# EAGLE design flukso.sensor.board.v1.2 (EAGLE 5.04)
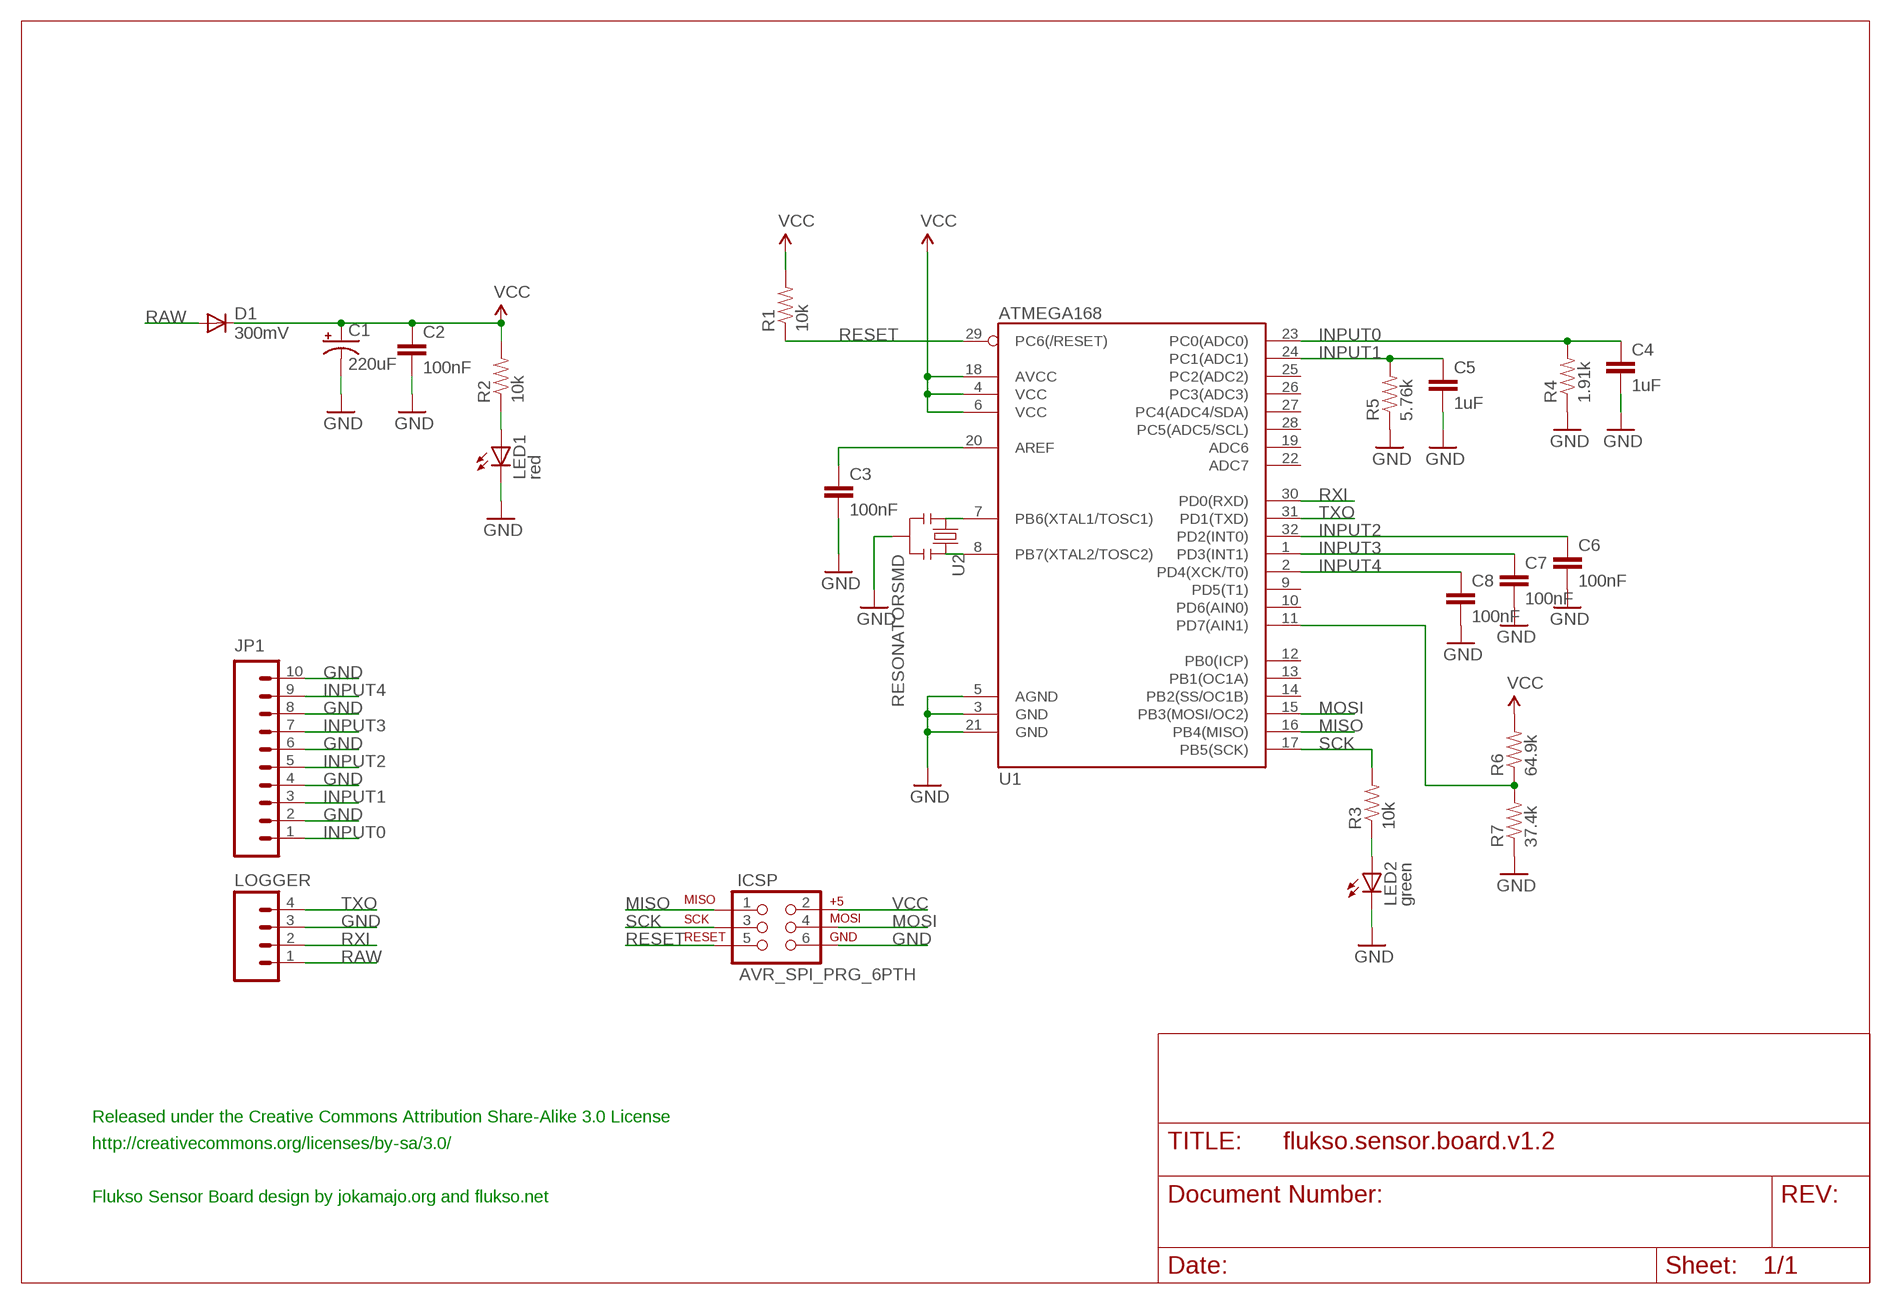
[diagram p0: schematic, sheet 1]

## Parts
C1  220uF  CPOL-USD  [PANASONIC_D]
C2  100nF  CAP0603  [0603]
C3  100nF  CAP0603  [0603]
C4  1uF  CAP0603  [0603]
C5  1uF  CAP0603  [0603]
C6  100nF  CAP0603  [0603]
C7  100nF  CAP0603  [0603]
C8  100nF  CAP0603  [0603]
D1  300mV  DIODESMB  [SMB-DIODE]
ICSP  AVR_SPI_PRG_6PTH  [2X3]
JP1  M10LOCK  [1X10_LOCK]
LED1  red  LED0603  [LED-0603]
LED2  green  LED0603  [LED-0603]
LOGGER  M04LOCK  [1X04_LOCK]
R1  10k  RESISTOR0603  [0603]
R2  10k  RESISTOR0603  [0603]
R3  10k  RESISTOR0603  [0603]
R4  1.91k  RESISTOR0603  [0603]
R5  5.76k  RESISTOR0603  [0603]
R6  64.9k  RESISTOR0603  [0603]
R7  37.4k  RESISTOR0603  [0603]
U1  ATMEGA168  [TQFP32-08]
U2  RESONATORSMD  [RESONATOR-SMD]

## Nets
GND: C1.- C2.2 C3.2 C4.2 C5.2 C6.2 C7.2 C8.2 ICSP.6 JP1.2 JP1.4 JP1.6 JP1.8 JP1.10 LED1.C LED2.C LOGGER.3 R4.1 R5.1 R7.1 U1.3(GND) U1.5(AGND) U1.21(GND) U2.2
INPUT0: C4.1 JP1.1 R4.2 U1.23(PC0(ADC0))
INPUT1: C5.1 JP1.3 R5.2 U1.24(PC1(ADC1))
INPUT2: C6.1 JP1.5 U1.32(PD2(INT0))
INPUT3: C7.1 JP1.7 U1.1(PD3(INT1))
INPUT4: C8.1 JP1.9 U1.2(PD4(XCK/T0))
MISO: ICSP.1 U1.16(PB4(MISO))
MOSI: ICSP.4 U1.15(PB3(MOSI/OC2))
N$1: R6.1 R7.2 U1.11(PD7(AIN1))
N$3: U1.7(PB6(XTAL1/TOSC1)) U2.1
N$4: U1.8(PB7(XTAL2/TOSC2)) U2.3
N$5: C3.1 U1.20(AREF)
N$6: LED1.A R2.1
N$7: LED2.A R3.1
RAW: D1.A LOGGER.1
RESET: ICSP.5 R1.1 U1.29(PC6(/RESET))
RXI: LOGGER.2 U1.30(PD0(RXD))
SCK: ICSP.3 R3.2 U1.17(PB5(SCK))
TXO: LOGGER.4 U1.31(PD1(TXD))
VCC: C1.+ C2.1 D1.C ICSP.2 R1.2 R2.2 R6.2 U1.4(VCC) U1.6(VCC) U1.18(AVCC)
Unconnected: U1.9(PD5(T1)) U1.10(PD6(AIN0)) U1.12(PB0(ICP)) U1.13(PB1(OC1A)) U1.14(PB2(SS/OC1B)) U1.19(ADC6) U1.22(ADC7) U1.25(PC2(ADC2)) U1.26(PC3(ADC3)) U1.27(PC4(ADC4/SDA)) U1.28(PC5(ADC5/SCL))

## Notes on the sheet
- Released under the Creative Commons Attribution Share-Alike 3.0 License
- http://creativecommons.org/licenses/by-sa/3.0/
- Flukso Sensor Board design by jokamajo.org and flukso.net

## Library data of the parts
C1 = rcl:CPOL-US: POLARIZED CAPACITOR, American symbol
C2-C8 = sparkFun:CAP: Capacitor Standard 0603 ceramic capacitor, and 0.1" leaded capacitor.
D1 = sparkFun:DIODE: Diode These are standard reverse protection diodes and small signal diodes. SMA package can handle up to about 1A. SOD-323 can handle about 200mA. What the SOD-323 package when ordering, there are some mfgs out there that are 5-pin packages.
ICSP = sparkFun:AVR_SPI_PRG_6: AVR ISP 6 Pin This is the reduced ISP connector for AVR programming. Common on Arduino. This footprint will take up less PCB space and can be used with a 10-pin to 6-pin adapter such as SKU: BOB-08508
JP1 = sparkFun:M10: Header 10 Standard 10-pin 0.1" header. Use with straight break away headers (SKU : PRT-00116), right angle break away headers (PRT-00553), swiss pins (PRT-00743), machine pins (PRT-00117), and female headers (PRT-00115).
LED1 LED2 = sparkFun:LED: LEDs Standard schematic elements and footprints for 5mm, 3mm, 1206, and 0603 sized LEDs. 5mm - Spark Fun Electronics SKU : COM-00529 (and others)
LOGGER = sparkFun:M04: Header 4 Standard 4-pin 0.1" header. Use with straight break away headers (SKU : PRT-00116), right angle break away headers (PRT-00553), swiss pins (PRT-00743), machine pins (PRT-00117), and female headers (PRT-00115). Molex polarized connector foot print use with SKU : PRT-08231 with associated crimp pins and housings.
R1-R7 = sparkFun:RESISTOR: Resistor Basic schematic elements and footprints for 0603, 1206, and PTH 1/10th watt (small) resistors.
U1 = sparkFun:ATMEGA168
U2 = sparkFun:RESONATOR: Resonator Small SMD resonator. This is the itty bitty 10/20MHz resonators with built in caps. CSTCE10M0G55 and CSTCE20M0V53. Footprint has been reviewed closely but hasn't been tested yet.

## Board
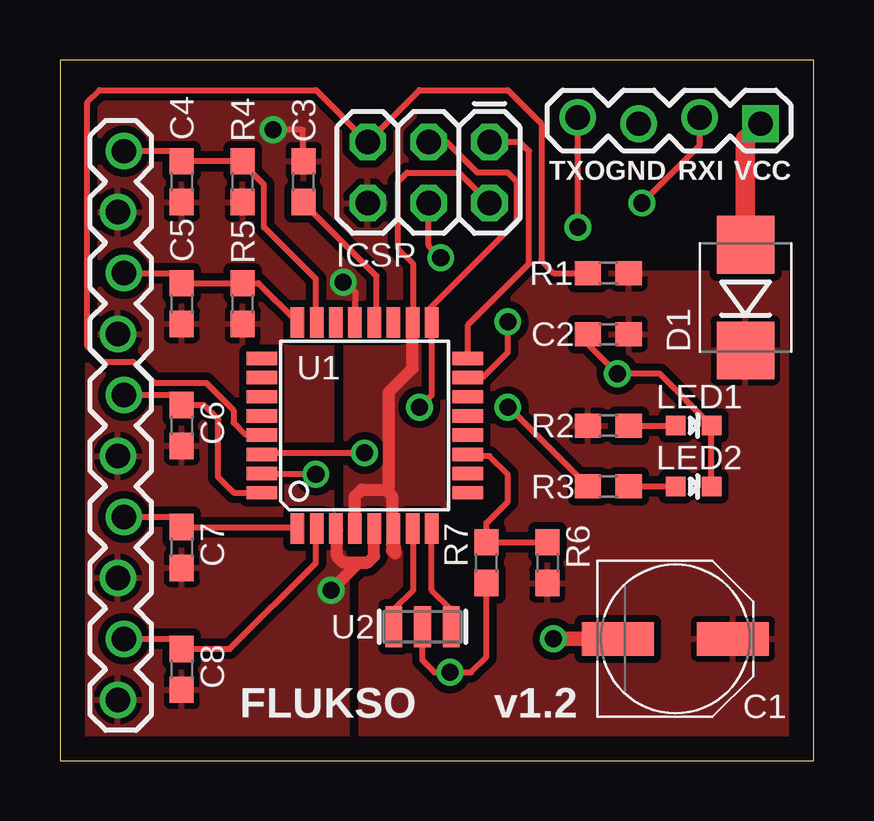
[diagram p1: board, top side]
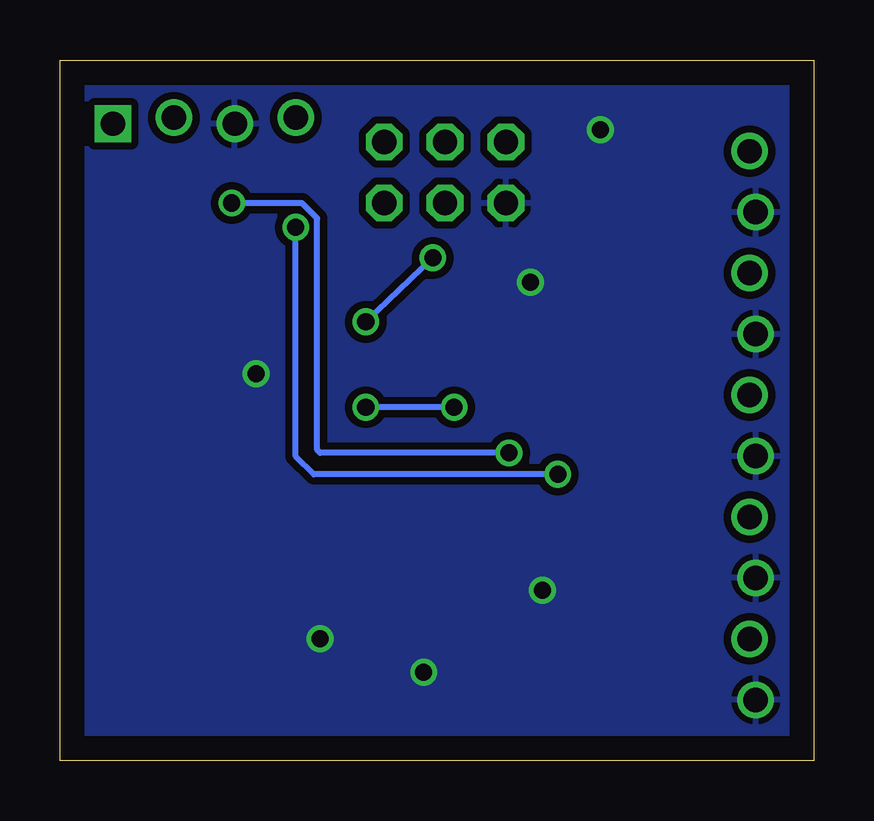
[diagram p2: board, bottom side, seen from below]

Size 31.42 x 29.2 mm. Coordinates in mm from the lower left corner, seen from the top.
Outline: 0,0 31.42,0 31.42,29.2 0,29.2 0,0
Copper layers (1*16): Top 0.035mm / dielectric 1.5mm / Bottom 0.035mm
Design rules "olimex.8mil": minimum track width 8mil, minimum drill 0.6mm, track to track 8mil, track to pad 8mil, pad to pad 8mil, via to via 8mil, smd to smd 8mil, copper to edge 40mil, drill to drill 10mil, minimum pad ring 10mil, minimum via ring 8mil, stop-mask expansion 0mil, vias tented up to drill 0mil, thermal gap 10mil

### Footprints (pad centres in the part's own frame; a part is rotated, then mirrored left to right if it is on the bottom)
PANASONIC_D = smd 3 x 1.4: + 2.4,0; - -2.4,0
0603 = smd 1.1 x 1: 1 -0.85,0; 2 0.85,0
SMB-DIODE = smd 2.4 x 2.4: A 2.2,0; C -2.2,0
2X3 = drill 1.016 octagon: 1 0,0; 2 0,2.54; 3 2.54,0; 4 2.54,2.54; 5 5.08,0; 6 5.08,2.54
1X10_LOCK = drill 1.016 round: 1 0,0.127; 2 2.54,-0.127; 3 5.08,0.127; 4 7.62,-0.127; 5 10.16,0.127; 6 12.7,-0.127; 7 15.24,0.127; 8 17.78,-0.127; 9 20.32,0.127; 10 22.86,-0.127
LED-0603 = smd 0.8 x 0.8: A 0,-0.75; C 0,0.75
1X04_LOCK = drill 1.016 square: 1 0,0.127 | drill 1.016 round: 2 2.54,-0.127; 3 5.08,0.127; 4 7.62,-0.127
TQFP32-08 = smd 1.27 x 0.559: 1 -4.293,2.8; 2 -4.293,2; 3 -4.293,1.2; 4 -4.293,0.4; 5 -4.293,-0.4; 6 -4.293,-1.2; 7 -4.293,-2; 8 -4.293,-2.8; 17 4.293,-2.8; 18 4.293,-2; 19 4.293,-1.2; 20 4.293,-0.4; 21 4.293,0.4; 22 4.293,1.2; 23 4.293,2; 24 4.293,2.8 | smd 0.559 x 1.27: 9 -2.8,-4.293; 10 -2,-4.293; 11 -1.2,-4.293; 12 -0.4,-4.293; 13 0.4,-4.293; 14 1.2,-4.293; 15 2,-4.293; 16 2.8,-4.293; 25 2.8,4.293; 26 2,4.293; 27 1.2,4.293; 28 0.4,4.293; 29 -0.4,4.293; 30 -1.2,4.293; 31 -2,4.293; 32 -2.8,4.293
RESONATOR-SMD = smd 0.7 x 1.7: 1 -1.2,0; 2 0,0; 3 1.2,0

### Placement (x,y rotation side)
C1  25.65,5.08 0 top
C2  22.86,17.78 180 top
C3  10.16,24.13 90 top
C4  5.08,24.13 270 top
C5  5.08,19.05 270 top
C6  5.08,13.97 270 top
C7  5.08,8.89 270 top
C8  5.08,3.81 270 top
D1  28.57,19.3 90 top
ICSP  17.91,25.78 180 top
JP1  2.54,25.4 270 top
LED1  26.42,13.97 270 top
LED2  26.42,11.43 270 top
LOGGER  29.21,26.67 180 top
R1  22.86,20.32 0 top
R2  22.86,13.97 180 top
R3  22.86,11.43 180 top
R4  7.62,24.13 90 top
R5  7.62,19.05 90 top
R6  20.32,8.26 270 top
R7  17.78,8.26 90 top
U1  12.7,13.97 90 top
U2  15.11,5.59 0 top

### Tracks (layer width: path | path; a pad name or v marks a point on that pad's centre or on a via)
GND  (via drill 0.71 pad 0.61)
  Top 0.254: U1.21 12.32,19.53 v11.81,19.94 | v8.89,26.29 10.12,26.29 C3.2 | C2.2 22.01,17.36 v23.24,16.13 25.01,16.13 LED1.C LED2.C | R7.1 17.78,4.32 17.14,3.68 v16.26,3.68 15.62,3.68 15.11,4.19 U2.2 | 4.87,23.28 C4.2 5.08,22.86 | C5.2 5.08,17.78
  Top 0.508: 11.5,9.58 U1.3 11.56,9.62 11.56,8.51 11.81,8.26 12.83,8.26 | U1.5 13.1,8.53 12.83,8.26 | 12.83,8.26 12.45,8.26 v11.3,7.11
  Top 0.61: v20.57,5.08 C1.-
  pour Bottom (isolate 0.305): 0,29.21 31.75,29.21 31.75,0 0,0
  pour Top (isolate 0.305): 0,29.21 14.73,29.21 14.73,18.92 11.3,18.92 11.3,10.54 11.94,8.13 11.94,0 0,0
INPUT0
  Top 0.254: JP1.1 4.66,25.4 C4.1 R4.2 7.62,24.89 8.51,24 8.51,22.23 10.67,20.07 10.67,18.3 U1.23
INPUT1
  Top 0.254: JP1.3 4.66,20.32 C5.1 R5.2 8.26,19.9 U1.24
INPUT2
  Top 0.254: JP1.5 4.66,15.24 C6.1 6.01,14.82 6.6,14.22 6.6,11.81 7.24,11.18 U1.32
INPUT3
  Top 0.254: JP1.7 4.66,10.16 C7.1 9.84,9.74 U1.1
INPUT4
  Top 0.254: JP1.9 4.66,5.08 C8.1 7.07,4.66 10.67,8.26 10.67,9.64 U1.2
MISO
  Top 0.254: ICSP.1 19.18,25.78 19.56,25.4 19.56,20.7 17.02,18.16 17.02,16.8 U1.16
MOSI  (via drill 0.71 pad 0.61)
  Top 0.254: ICSP.4 15.37,21.46 v15.88,20.95 | v18.67,18.29 18.67,17.02 17.65,16 17.02,16 U1.15
  Bottom 0.254: v18.67,18.29 v15.88,20.95
N$1
  Top 0.254: R6.1 R7.2 17.78,9.91 18.67,10.79 18.67,11.94 17.91,12.7 17.06,12.7 U1.11
N$3
  Top 0.254: U2.1 13.91,6.29 14.73,7.11 14.73,9.64 U1.7
N$4
  Top 0.254: U2.3 16.31,6.29 15.49,7.11 U1.8
N$5
  Top 0.254: 13.08,18.28 U1.20 13.21,18.37 13.21,20.19 10.16,23.24 C3.1
N$6
  Top 0.254: R2.1 LED1.A
N$7
  Top 0.254: R3.1 LED2.A
RAW
  Top 0.813: D1.A 28.57,25.91 LOGGER.1
RESET
  Top 0.254: R1.1 20.57,20.32 20.07,20.83 20.07,26.54 18.67,27.94 14.99,27.94 ICSP.5 10.67,27.94 1.65,27.94 1.14,27.43 1.14,17.27 1.78,16.64 3.05,16.64 3.94,15.75 6.1,15.75 7.24,14.61 7.24,14.1 7.75,13.59 8.39,13.59 U1.29
RXI  (via drill 0.71 pad 0.61)
  Top 0.254: LOGGER.2 26.67,25.65 v24.26,23.24 | v12.7,12.83 8.46,12.83 U1.30
  Bottom 0.254: v24.26,23.24 21.34,23.24 20.7,22.61 20.7,12.95 20.57,12.83 v12.7,12.83
SCK  (via drill 0.71 pad 0.61)
  Top 0.254: ICSP.3 16.13,25.78 17.4,24.51 18.67,24.51 19.05,24.13 19.05,22.48 15.37,18.8 15.37,18.4 U1.17 15.5,15.25 v14.99,14.73 | v18.67,14.73 18.67,14.77 R3.2
  Bottom 0.254: v14.99,14.73 v18.67,14.73
TXO  (via drill 0.71 pad 0.61)
  Top 0.254: v21.59,22.23 LOGGER.4 | U1.31 10.64,11.97 v10.67,11.94
  Bottom 0.254: v21.59,22.23 21.59,12.7 20.83,11.94 v10.67,11.94
VCC
  Top 0.254: ICSP.2 16.64,24.51 14.48,24.51 14.1,24.13 14.1,21.34 14.73,20.7 14.73,18.3 U1.18 | R2.2 21.84,13.97
  Top 0.508: U1.4 12.3,11.03 12.57,11.3 13.59,11.3 | 13.59,11.3 13.84,11.05 13.84,9.02 | U1.18 14.7,16.35 13.72,15.37 13.72,11.43 13.59,11.3 | 13.84,9.02 13.84,8.76 13.97,8.64 13.97,8.89 13.84,9.02
  pour Top (isolate 0.305): 12.57,10.03 16.76,10.03 16.76,20.32 31.75,20.32 31.75,0 12.57,0
  pour Top (isolate 0.305): 11.94,17.4 16.13,17.4 16.13,10.54 11.94,10.54

### Text on the board
tPlace: TXO | GND | RXI | VCC | FLUKSO | v1.2